# EasyEDA schematic EasyEDA.json
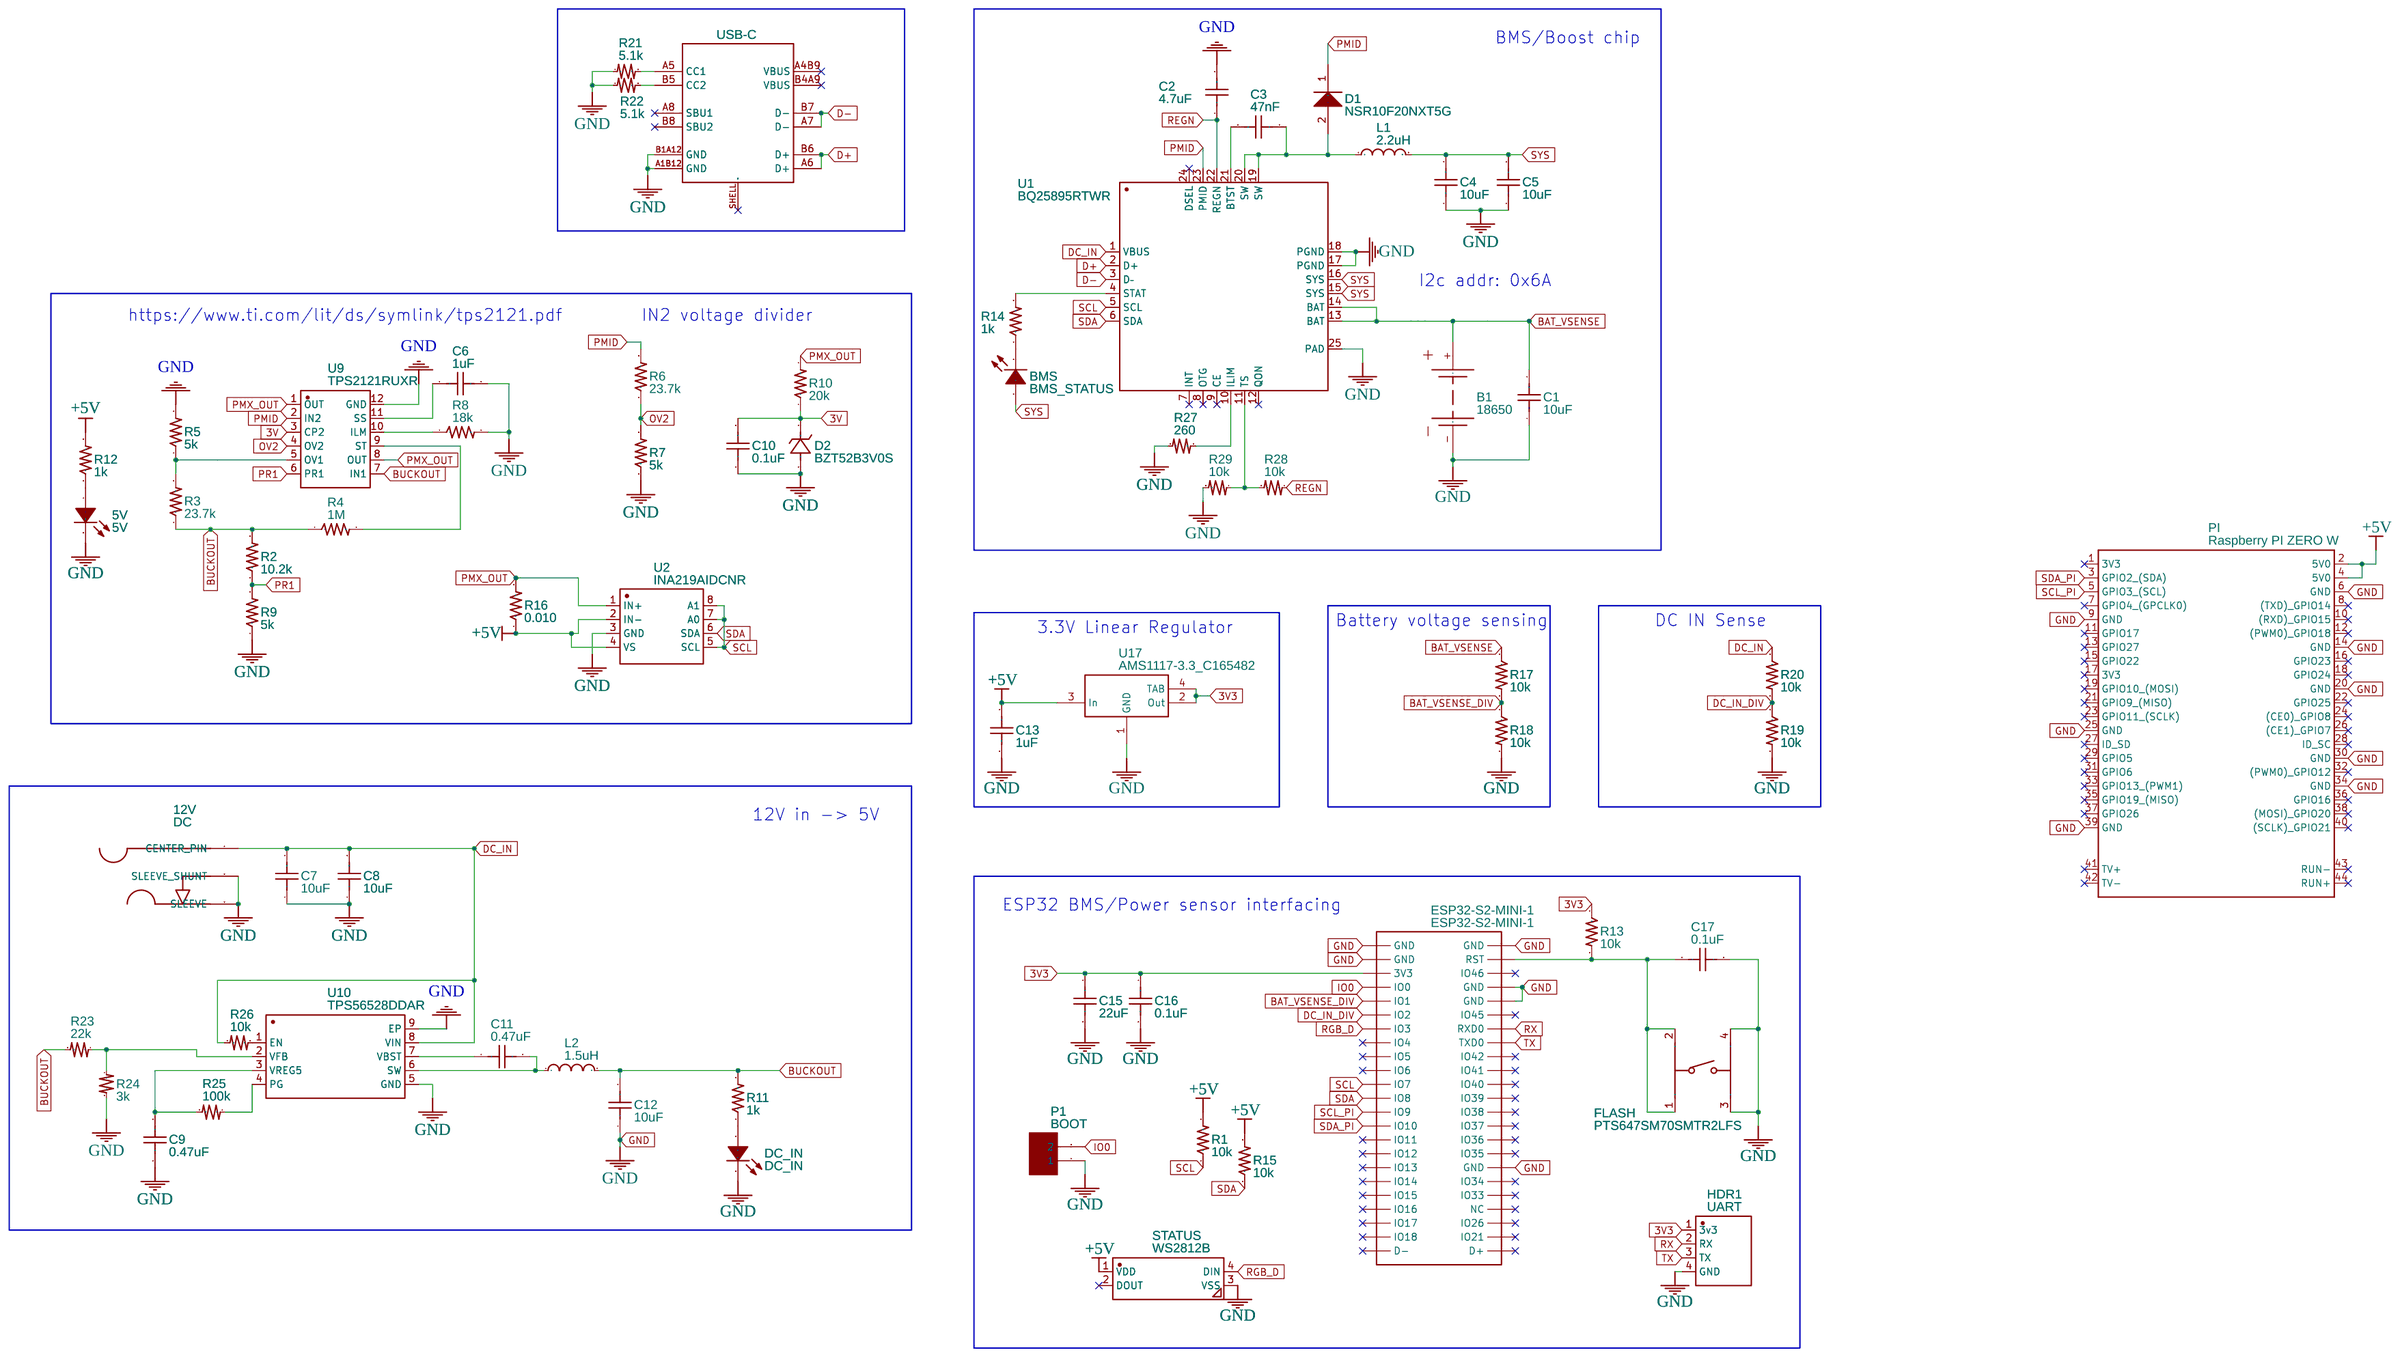
[diagram p0: schematic sheet]

## Parts
5V  5V  [LED-SMD_0805-R-RD]
12V  DC  [RASM712BKZ]
B1  18650  [18650-BATT-HLDR]
BMS  BMS_STATUS  [LED-SMD_0805-R-RD]
C1  10uF  [C0805]
C2  4.7uF  [C0805]
C3  47nF  [C0805]
C4  10uF  [C0805]
C5  10uF  [C0805]
C6  1uF  [C0805]
C7  10uF  [C0805]
C8  10uF  [C0805]
C9  0.47uF  [C0805]
C10  0.1uF  [C0805]
C11  0.47uF  [C0805]
C12  10uF  [C0805]
C13  1uF  [C0805]
C15  22uF  [C0805]
C16  0.1uF  [C0805]
C17  0.1uF  [C0805]
D1  NSR10F20NXT5G  [DSN2_L1.6-W0.8-RD]
D2  BZT52B3V0S  [SOD-323_L1.8-W1.3-LS2.5-RD]
DC_IN  DC_IN  [LED-SMD_0805-R-RD]
ESP32-S2-MINI-1  ESP32-S2-MINI-1  [ESP32-S2-MINI-1]
FLASH  PTS647SM70SMTR2LFS  [KEY-SMD_4P-L4.5-W4.5-P3.00-LS6.5-TL]
HDR1  UART  [HDR1X4]
L1  2.2uH  [L0805]
L2  1.5uH  [IND-SMD_L11.0-W10.0]
P1  BOOT  [HDR1X2]
PI  Raspberry PI ZERO W  [PI-ZERO-HDR]
R1  10k  [0805]
R2  10.2k  [0805]
R3  23.7k  [0805]
R4  1M  [0805]
R5  5k  [0805]
R6  23.7k  [0805]
R7  5k  [0805]
R8  18k  [0805]
R9  5k  [0805]
R10  20k  [0805]
R11  1k  [0805]
R12  1k  [0805]
R13  10k  [0805]
R14  1k  [0805]
R15  10k  [0805]
R16  0.010  [0805]
R17  10k  [0805]
R18  10k  [0805]
R19  10k  [0805]
R20  10k  [0805]
R21  5.1k  [0805]
R22  5.1k  [0805]
R23  22k  [0805]
R24  3k  [0805]
R25  100k  [0805]
R26  10k  [0805]
R27  260  [0805]
R28  10k  [0805]
R29  10k  [0805]
STATUS  WS2812B  [LED-SMD_4P-L5.0-W5.0-TL]
U1  BQ25895RTWR  [QFN-24_L4.0-W4.0-P0.50-TL-EP2.7]
U2  INA219AIDCNR  [SOT-23-8_L3.0-W1.7-P0.65-LS2.8-BR]
U9  TPS2121RUXR  [VQFN-HR-12_L2.5-W2.0-P0.50-BL]
U10  TPS56528DDAR  [SOIC-8_L4.9-W3.9-P1.27-LS6.0-BL-EP]
U17  AMS1117-3.3_C165482  [SOT-223_L6.5-W3.5-P2.30-LS7.0-BR]
VBUS  USB-C  [HRO-TYPE-C-31-M-12-HANDSOLDERING]

## Library data of the parts
5V BMS DC_IN = 0805 LED: Supplier: LCSC; Supplier Part: C375451; Manufacturer: EKINGLUX; Manufacturer Part: E6C0805URAC1UDA; Contributor: LCSC
12V = RASM712BKZ: Contributor: chillyphilly
B1 = 18650: Contributor: Dezcript
C1-C13 C15-C17 = 0603ZD106KAT2A: Supplier: LCSC; Supplier Part: C2167556; Manufacturer: AVX; JLCPCB Part Class: Extended Part; Contributor: LCSC
D1 = NSR10F20NXT5G: Schottky Barrier Diode, 2-Pin DSN, Pb-Free, Tape and Reel
D2 = BZT52B3V0S_C699123: Supplier: LCSC; Supplier Part: C699123; Manufacturer: Yangzhou Yangjie Elec Tech; Contributor: LCSC; JLCPCB Part Class: Extended Part
ESP32-S2-MINI-1 = ESP32-S2-MINI-1: Contributor: MarvinVoetmann
FLASH = PTS647SM70SMTR2LFS: Supplier: LCSC; Supplier Part: C2689517; Manufacturer: C&K; JLCPCB Part Class: Extended Part; Contributor: LCSC
HDR1 = RE-H042TD-1190(LF)(SN): Supplier: LCSC; Supplier Part: C265319; Manufacturer: JST Sales America; Contributor: LCSC
L1 = 36502AR36JTDG: Supplier: LCSC; Supplier Part: C1330274; Manufacturer: TE Connectivity(美国泰科); JLCPCB Part Class: Extended Part; Contributor: LCSC
L2 = YXMAC1040-1R5M-ITF: Supplier: LCSC; Supplier Part: C241406; Manufacturer: YUXIN TECH; Contributor: LCSC; JLCPCB Part Class: Extended Part
P1 = HDR1X2: sourceId: dV3XRL2kC
PI = Raspberry PI ZERO W: Contributor: dedboi98
R1-R20 = 0.22OHM-1_4W-1%(0805): RES-09883; Contributor: SparkFun
R21-R29 = 0805 Resistor: Supplier: Digi-Key; Contributor: stanisjw
STATUS = WS2812B: Supplier: LCSC; Manufacturer: Worldsemi; Contributor: LCSC; Supplier Part: C114585; JLCPCB Part Class: Extended Part
U1 = BQ25895RTWR: Supplier: LCSC; Manufacturer: TI; Contributor: LCSC; Supplier Part: C80200; JLCPCB Part Class: Extended Part
U2 = INA219AIDCNR: Supplier: LCSC; Manufacturer: TI; Contributor: LCSC; Supplier Part: C87469; JLCPCB Part Class: Extended Part
U9 = TPS2121RUXR: Supplier: LCSC; Supplier Part: C485916; Manufacturer: Texas Instruments; Contributor: LCSC; JLCPCB Part Class: Extended Part
U10 = TPS56528DDAR: Supplier: LCSC; Supplier Part: C138716; Manufacturer: Texas Instruments; Contributor: LCSC; JLCPCB Part Class: Extended Part
U17 = AMS1117-3.3_C165482: Supplier: LCSC; Supplier Part: C165482; Manufacturer: SK; Manufacturer Part: AMS1117-3.3; Contributor: LCSC; JLCPCB Part Class: Extended Part
VBUS = USB-C: Manufacturer Part: XKB Enterprise; Supplier: LCSC; Supplier Part: C319148; link: https://www.digikey.ca/product-detail/en/gct/USB4085-GF-A/2073-USB4085-GF-ACT-ND/9859733; Contributor: geocipher

## Nets
3V: C10.2 D2.1(C) R10.1 U9.3(CP2)
3V3: C15.1 C16.1 ESP32-S2-MINI-1.3(3V3) HDR1.1(3v3) R13.1 U17.2(Out) U17.4(TAB)
+5V: C13.1 PI.2(5V0) PI.4(5V0) R1.2 R12.2 R15.2 R16.1 STATUS.1(VDD) U2.2(IN-) U2.4(VS) U17.3(In)
GND: 5V.2(K) 12V.2(SLEEVE SHUNT) 12V.3(SLEEVE) B1.-(2) C1.1 C2.2 C4.1 C5.1 C6.2 C7.1 C8.1 C9.1 C10.1 C12.1 C13.2 C15.2 C16.2 C17.2 D2.2(A) DC_IN.2(K) ESP32-S2-MINI-1.GND FLASH.3 FLASH.4 HDR1.4(GND) P1.1 PI.6(GND) PI.9(GND) PI.14(GND) PI.20(GND) PI.25(GND) PI.30(GND) PI.34(GND) PI.39(GND) R5.2 R7.1 R8.2 R9.1 R18.2 R19.2 R21.1 R22.1 R24.2 R27.1 R29.2 STATUS.3(VSS) U1.17(PGND) U1.18(PGND) U1.25(PAD) U2.3(GND) U9.12(GND) U10.5(GND) U10.9(EP) U17.1(GND) VBUS.A1B12(GND) VBUS.B1A12(GND)
BAT_VSENSE: B1.+(1) C1.2 R17.1 U1.13(BAT) U1.14(BAT)
BAT_VSENSE_DIV: ESP32-S2-MINI-1.5(IO1) R17.2 R18.1
BUCKOUT: C12.2 L2.2 R2.2 R3.1 R4.1 R11.2 R23.2 U9.7(IN1)
D+: U1.2(D+) VBUS.A6(D+) VBUS.B6(D+)
D-: U1.3(D–) VBUS.A7(D-) VBUS.B7(D-)
DC_IN: 12V.1(CENTER PIN) C7.2 C8.2 R20.1 R26.2 U1.1(VBUS) U10.8(VIN)
DC_IN_DIV: ESP32-S2-MINI-1.6(IO2) R19.1 R20.2
IO0: ESP32-S2-MINI-1.4(IO0) P1.2
OV2: R6.1 R7.2 U9.4(OV2)
PMID: D1.1(K) R6.2 U1.23(PMID) U9.2(IN2)
PMX_OUT: R10.2 R16.2 U2.1(IN+) U9.1(OUT) U9.8(OUT)
PR1: R2.1 R9.2 U9.6(PR1)
REGN: C2.1 R28.1 U1.22(REGN)
RGB_D: ESP32-S2-MINI-1.7(IO3) STATUS.4(DIN)
RX: ESP32-S2-MINI-1.40(RXD0) HDR1.2(RX)
SCL: ESP32-S2-MINI-1.11(IO7) R1.1 U1.5(SCL) U2.5(SCL) U2.7(A0) U2.8(A1)
SCL_PI: ESP32-S2-MINI-1.13(IO9) PI.5(GPIO3 (SCL))
SDA: ESP32-S2-MINI-1.12(IO8) R15.1 U1.6(SDA) U2.6(SDA)
SDA_PI: ESP32-S2-MINI-1.14(IO10) PI.3(GPIO2 (SDA))
SYS: BMS.1(A) C4.2 C5.2 L1.2 U1.15(SYS) U1.16(SYS)
TX: ESP32-S2-MINI-1.39(TXD0) HDR1.3(TX)
Net-(5V-1): 5V.1(A) R12.1
Net-(BMS-2): BMS.2(K) R14.1
Net-(C3-1): C3.1 D1.2(A) L1.1 U1.19(SW) U1.20(SW)
Net-(C3-2): C3.2 U1.21(BTST)
Net-(C6-1): C6.1 U9.11(SS)
Net-(C9-2): C9.2 R25.2 U10.3(VREG5)
Net-(C11-1): C11.1 U10.7(VBST)
Net-(C11-2): C11.2 L2.1 U10.6(SW)
Net-(C17-1): C17.1 ESP32-S2-MINI-1.45(RST) FLASH.1 FLASH.2 R13.2
Net-(DC_IN-1): DC_IN.1(A) R11.1
Net-(R3-2): R3.2 R5.1 U9.5(OV1)
Net-(R4-2): R4.2 U9.9(ST)
Net-(R8-1): R8.1 U9.10(ILM)
Net-(R14-2): R14.2 U1.4(STAT)
Net-(R21-2): R21.2 VBUS.A5(CC1)
Net-(R22-2): R22.2 VBUS.B5(CC2)
Net-(R23-1): R23.1 R24.1 U10.2(VFB)
Net-(R25-1): R25.1 U10.4(PG)
Net-(R26-1): R26.1 U10.1(EN)
Net-(R27-2): R27.2 U1.10(ILIM)
Net-(R28-2): R28.2 R29.1 U1.11(TS)

Not connected (* = marked no-connect by the designer): ESP32-S2-MINI-1 8(IO4)* 9(IO5)* 10(IO6)* 15(IO11)* 16(IO12)* 17(IO13)* 18(IO14)* 19(IO15)* 20(IO16)* 21(IO17)* 22(IO18)* 23(D-)* 24(D+)* 25(IO21)* 26(IO26)* 27(NC)* 28(IO33)* 29(IO34)* 31(IO35)* 32(IO36)* 33(IO37)* 34(IO38)* 35(IO39)* 36(IO40)* 37(IO41)* 38(IO42)* 41(IO45)* 44(IO46)*; PI 1(3V3)* 7(GPIO4 (GPCLK0))* 8((TXD) GPIO14)* 10((RXD) GPIO15)* 11(GPIO17)* 12((PWM0) GPIO18)* 13(GPIO27)* 15(GPIO22)* 16(GPIO23)* 17(3V3)* 18(GPIO24)* 19(GPIO10 (MOSI))* 21(GPIO9 (MISO))* 22(GPIO25)* 23(GPIO11 (SCLK))* 24((CE0) GPIO8)* 26((CE1) GPIO7)* 27(ID_SD)* 28(ID_SC)* 29(GPIO5)* 31(GPIO6)* 32((PWM0) GPIO12)* 33(GPIO13 (PWM1))* 35(GPIO19 (MISO))* 36(GPIO16)* 37(GPIO26)* 38((MOSI) GPIO20)* 40((SCLK) GPIO21)* 41(TV+)* 42(TV-)* 43(RUN-)* 44(RUN+)*; STATUS 2(DOUT)*; U1 7(INT)* 8(OTG)* 9(CE)* 12(QON)* 24(DSEL)*; VBUS A4B9(VBUS)* A8(SBU1)* B4A9(VBUS)* B8(SBU2)* SHELL(SHIELD)*

## Notes on the sheet
- BMS/Boost chip
- I2c addr: 0x6A
- https://www.ti.com/lit/ds/symlink/tps2121.pdf
- IN2 voltage divider
- 3.3V Linear Regulator
- Battery voltage sensing
- DC IN Sense
- 12V in -> 5V
- ESP32 BMS/Power sensor interfacing
